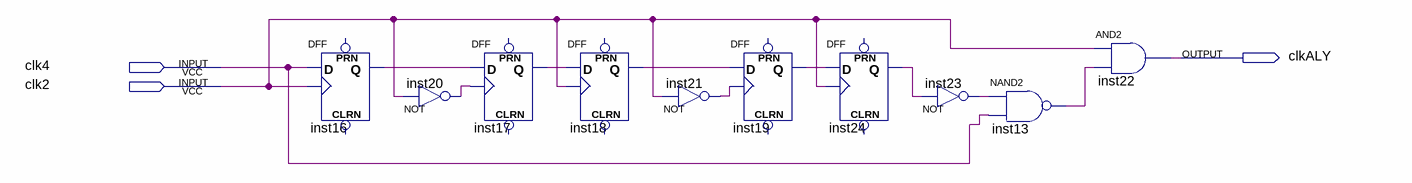
[diagram p0: schematic sheet]
// Quartus schematic CLK_COUNTER.bdf as structural Verilog: 10 symbols, 3 pins
module CLK_COUNTER (
  input  clk4,
  input  clk2,
  output clkALY
);

  wire inst13_out, inst16_q, inst17_q, inst18_q, inst19_q, inst20_out, inst21_out, inst23_out, inst24_q;

  DFF inst16 (.CLK(clk2), .D(clk4), .Q(inst16_q));  // open: CLRN, PRN
  not inst20 (inst20_out, clk2);
  DFF inst17 (.CLK(inst20_out), .D(inst16_q), .Q(inst17_q));  // open: CLRN, PRN
  DFF inst18 (.CLK(clk2), .D(inst17_q), .Q(inst18_q));  // open: CLRN, PRN
  not inst21 (inst21_out, clk2);
  DFF inst19 (.CLK(inst21_out), .D(inst18_q), .Q(inst19_q));  // open: CLRN, PRN
  DFF inst24 (.CLK(clk2), .D(inst19_q), .Q(inst24_q));  // open: CLRN, PRN
  not inst23 (inst23_out, inst24_q);
  nand inst13 (inst13_out, inst23_out, clk4);
  and inst22 (clkALY, clk2, inst13_out);
endmodule
